# Altium project UNO MEDIA CARRIER.PrjPcb (part 2 of 2)

## Sheet LED_RGB.SchDoc: LED RGB
size A4; SheetNumber: 11; SheetTotal: 11
Used 4 times, as channels U_LED_RGB_1, U_LED_RGB_2, U_LED_RGB_3, U_LED_RGB_4. Parts and nets are listed once, with the designators drawn on the sheet.
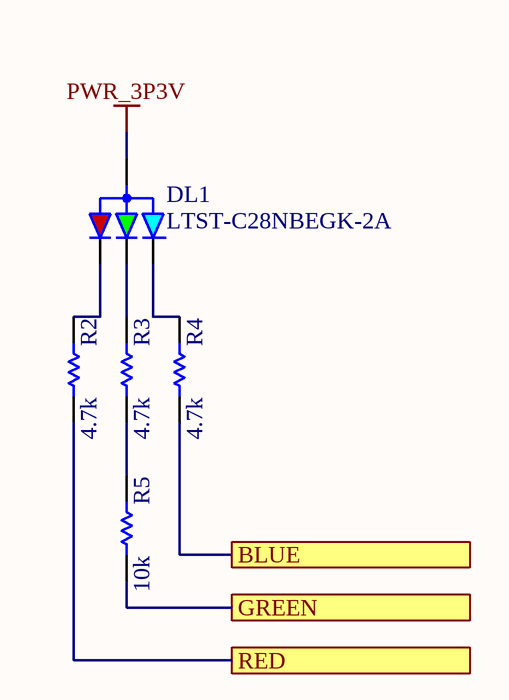
[diagram p10: LED_RGB.SchDoc]

### Parts
DL1  LTST-C28NBEGK-2A  [SMLP34RGB2W]
R2  value 4.7k  [RES-0402]  (hidden comment: RC0402FR-074K7L)
R3  value 4.7k  [RES-0402]  (hidden comment: RC0402FR-074K7L)
R4  value 4.7k  [RES-0402]  (hidden comment: RC0402FR-074K7L)
R5  value 10k  [RES-0402]  (hidden comment: CRCW040210K0FKED)

### Ports
BLUE, GREEN, RED

### Nets
PWR_3P3V: DL1.1(ANODE)
BLUE: R4.1 ; port BLUE
GREEN: R5.2 ; port GREEN
RED: R2.1 ; port RED
NetDL1_2: DL1.2(RED_C) R2.2
NetDL1_3: DL1.3(BLUE_C) R4.2
NetDL1_4: DL1.4(GREEN_C) R3.2
NetR3_1: R3.1 R5.1

### Channels
U_LED_RGB_1: designators end in _1; ports BLUE=NetR4_1_1 GREEN=NetR5_1_2 RED=NetR2_1_1
U_LED_RGB_2: designators end in _2; ports BLUE=NetR4_2_1 GREEN=NetR5_2_2 RED=NetR2_2_1
U_LED_RGB_3: designators end in _3; ports BLUE=NetR4_3_1 GREEN=NetR5_3_2 RED=NetR2_3_1
U_LED_RGB_4: designators end in _4; ports BLUE=NetR4_4_1 GREEN=NetR5_4_2 RED=NetR2_4_1

### Notes on the sheet
- Title:
- ID:
- Date:
- Time:
- Version:
- Sheet
- of
- RevAuthor:
- Reference Designs ARE PROVIDED "AS IS" AND "WITH ALL FAULTS. Arduino SA DISCLAIMS ALL OTHER WARRANTIES, EXPRESS OR IMPLIED, REGARDING PRODUCTS, INCLUDING BUT NOT LIMITED TO, ANY IMPLIED WARRANTIES OF MERCHANTABILITY OR FITNESS FOR A PARTICULAR PURPOSE.
  Arduino SA may make changes to specifications and product descriptions at any time, without notice. The Customer must not rely on the absence or characteristics of any features or instructions marked "reserved" or "undefined". Arduino SA reserves these for future definition and shall have no responsibility whatsoever for conflicts or incompatibilities arising from future changes to them. The product information on the Web Site or Materials is subject to change without notice.
  Do not finalize a design with this info. ARDUINO and other Arduino brands and logos and Trademarks of Arduino SA. All Arduino SA Trademarks cannot be used without owner's formal permission.
- File:
- Author:

### Library data of the parts
DL1 = L0014-A.13: LED RGB DIFFUSED PICOLED SMD; Manufacturer: Liteon; Code Arduino: A5469; Dominant Wavelength: 470nm; Forward Current: 20mA; Luminous Intensity: 45mcd; Forward Voltage: 3V; Lens Color: White; Lens Style: Rectangular; Test Current: 5mA; Pin Count: 4; Part Number: LTST-C28NBEGK-2A; Length: 1mm; Color: Blue,Green,Red; Width: 1mm; Lens Transparency: Diffused; Case Code (Imperial): 0404; Min Operating Temperature: -40°C; Height: 0.25mm; Max Operating Temperature: 85°C
R2-R4 = R0013-A.24: RES CHIP 0402 4k7 1% 1/16W; Manufacturer: YAGEO; Code Arduino: 2196; Power: 62.5mW; Temperature coefficient: 200ppm; Part Number: RC0402FR-074K7L; Tolerance: 1%; Case Code (Imperial): 0402; Technology: Thick film
R5 = R0003-A.24: RES CHIP 0402 10k 1% 1/16W; Manufacturer: Vishay; Code Arduino: 0136; Power: 62.5mW; Temperature coefficient: 100ppm; Case Code (Imperial): 0402; Part Number: CRCW040210K0FKED; Technology: Thick film; Tolerance: 1%

## Nets that join several sheets
+5V: TOP (J13.2), HEADERS_UNOQ_MALE (JMISC_MALE.54 JMISC_MALE.56), HEADERS_UNOQ_FEMALE (J9.54 J9.56)
DC_IN: TOP (J13.3), HEADERS_UNOQ_MALE (JMEDIA_MALE.57 JMEDIA_MALE.59), HEADERS_UNOQ_FEMALE (J8.57 J8.59)
GND: TOP (J10.4 J13.4 QR1.PAD TP21.X), HEADERS_UNOQ_MALE (27 pins), U_FLAT_CSI (8 pins), U_TRANSLATOR_I2C (6 pins), U_FLAT_CSI (8 pins), U_TRANSLATOR_I2C (6 pins), DSI_FLAT (8 pins), AUDIO_EAR (5 pins), AUDIO_HEADPHONES_MIC (7 pins), AUDIO_LINEOUT (D7.A D8.A J7.4 R10.1), HEADERS_UNOQ_FEMALE (27 pins), EXPANDER_I2C (6 pins)
PWR_3P3V: TOP (J13.1 TP22.X), HEADERS_UNOQ_MALE (JMEDIA_MALE.58 JMEDIA_MALE.60 JMISC_MALE.53 JMISC_MALE.55), U_FLAT_CSI (J3_2.22), U_TRANSLATOR_I2C (5 pins), U_FLAT_CSI (J3_1.22), U_TRANSLATOR_I2C (5 pins), DSI_FLAT (J4.22), HEADERS_UNOQ_FEMALE (J8.58 J8.60 J9.53 J9.55), EXPANDER_I2C (6 pins), U_LED_RGB_1 (DL1_1.1), U_LED_RGB_2 (DL1_2.1), U_LED_RGB_3 (DL1_3.1), U_LED_RGB_4 (DL1_4.1)
VBAT: TOP (J10.1), HEADERS_UNOQ_MALE (JMISC_MALE.60), HEADERS_UNOQ_FEMALE (J9.60)
VCC_PX3_1P8: TOP (J10.3 TP20.X), HEADERS_UNOQ_MALE (JMISC_MALE.57), U_TRANSLATOR_I2C (6 pins), U_TRANSLATOR_I2C (6 pins), HEADERS_UNOQ_FEMALE (J9.57)
VCOIN: TOP (J10.2), HEADERS_UNOQ_MALE (JMISC_MALE.59), HEADERS_UNOQ_FEMALE (J9.59)
CSI0_CK_N: HEADERS_UNOQ_MALE (JMEDIA_MALE.33), U_FLAT_CSI (J3_2.8)
CSI0_CK_P: HEADERS_UNOQ_MALE (JMEDIA_MALE.35), U_FLAT_CSI (J3_2.9)
CSI0_D0_N: HEADERS_UNOQ_MALE (JMEDIA_MALE.21), U_FLAT_CSI (J3_2.2)
CSI0_D0_P: HEADERS_UNOQ_MALE (JMEDIA_MALE.23), U_FLAT_CSI (J3_2.3)
CSI0_D1_N: HEADERS_UNOQ_MALE (JMEDIA_MALE.27), U_FLAT_CSI (J3_2.5)
CSI0_D1_P: HEADERS_UNOQ_MALE (JMEDIA_MALE.29), U_FLAT_CSI (J3_2.6)
CSI0_D2_N: HEADERS_UNOQ_MALE (JMEDIA_MALE.39), U_FLAT_CSI (J3_2.11)
CSI0_D2_P: HEADERS_UNOQ_MALE (JMEDIA_MALE.41), U_FLAT_CSI (J3_2.12)
CSI0_D3_N: HEADERS_UNOQ_MALE (JMEDIA_MALE.45), U_FLAT_CSI (J3_2.14)
CSI0_D3_P: HEADERS_UNOQ_MALE (JMEDIA_MALE.47), U_FLAT_CSI (J3_2.15)
CSI1_CK_N: HEADERS_UNOQ_MALE (JMEDIA_MALE.42), U_FLAT_CSI (J3_1.8)
CSI1_CK_P: HEADERS_UNOQ_MALE (JMEDIA_MALE.40), U_FLAT_CSI (J3_1.9)
CSI1_D0_N: HEADERS_UNOQ_MALE (JMEDIA_MALE.54), U_FLAT_CSI (J3_1.2)
CSI1_D0_P: HEADERS_UNOQ_MALE (JMEDIA_MALE.52), U_FLAT_CSI (J3_1.3)
CSI1_D1_N: HEADERS_UNOQ_MALE (JMEDIA_MALE.48), U_FLAT_CSI (J3_1.5)
CSI1_D1_P: HEADERS_UNOQ_MALE (JMEDIA_MALE.46), U_FLAT_CSI (J3_1.6)
CSI1_D2_N: HEADERS_UNOQ_MALE (JMEDIA_MALE.36), U_FLAT_CSI (J3_1.11)
CSI1_D2_P: HEADERS_UNOQ_MALE (JMEDIA_MALE.34), U_FLAT_CSI (J3_1.12)
CSI1_D3_N: HEADERS_UNOQ_MALE (JMEDIA_MALE.30), U_FLAT_CSI (J3_1.14)
CSI1_D3_P: HEADERS_UNOQ_MALE (JMEDIA_MALE.28), U_FLAT_CSI (J3_1.15)
DSI_CLK_N: HEADERS_UNOQ_MALE (JMEDIA_MALE.3), DSI_FLAT (J4.8)
DSI_CLK_P: HEADERS_UNOQ_MALE (JMEDIA_MALE.5), DSI_FLAT (J4.9)
DSI_D0_N: HEADERS_UNOQ_MALE (JMEDIA_MALE.12), DSI_FLAT (J4.2)
DSI_D0_P: HEADERS_UNOQ_MALE (JMEDIA_MALE.10), DSI_FLAT (J4.3)
DSI_D1_N: HEADERS_UNOQ_MALE (JMEDIA_MALE.6), DSI_FLAT (J4.5)
DSI_D1_P: HEADERS_UNOQ_MALE (JMEDIA_MALE.4), DSI_FLAT (J4.6)
DSI_D2_N: HEADERS_UNOQ_MALE (JMEDIA_MALE.9), DSI_FLAT (J4.11)
DSI_D2_P: HEADERS_UNOQ_MALE (JMEDIA_MALE.11), DSI_FLAT (J4.12)
DSI_D3_N: HEADERS_UNOQ_MALE (JMEDIA_MALE.15), DSI_FLAT (J4.14)
DSI_D3_P: HEADERS_UNOQ_MALE (JMEDIA_MALE.17), DSI_FLAT (J4.15)
EAR.EAR_M: HEADERS_UNOQ_MALE (JMISC_MALE.30), AUDIO_EAR (C2.2 D2.C J5.4 R6.2), HEADERS_UNOQ_FEMALE (J9.30)
EAR.EAR_P: HEADERS_UNOQ_MALE (JMISC_MALE.28), AUDIO_EAR (C11.2 D1.C J5.2), HEADERS_UNOQ_FEMALE (J9.28)
GPIO_22: HEADERS_UNOQ_MALE (JMEDIA_MALE.53), U_TRANSLATOR_I2C (R20_2.1 U2_2.4), HEADERS_UNOQ_FEMALE (J8.53)
GPIO_23: HEADERS_UNOQ_MALE (JMEDIA_MALE.51), U_TRANSLATOR_I2C (R21_2.1 U2_2.5), HEADERS_UNOQ_FEMALE (J8.51)
GPIO_29: HEADERS_UNOQ_MALE (JMEDIA_MALE.22), U_TRANSLATOR_I2C (R20_1.1 U2_1.4), HEADERS_UNOQ_FEMALE (J8.22)
GPIO_30: HEADERS_UNOQ_MALE (JMEDIA_MALE.24), U_TRANSLATOR_I2C (R21_1.1 U2_1.5), HEADERS_UNOQ_FEMALE (J8.24)
HEADPHONES.HPH_L: HEADERS_UNOQ_MALE (JMISC_MALE.36), AUDIO_HEADPHONES_MIC (D6.C J6.2), HEADERS_UNOQ_FEMALE (J9.36)
HEADPHONES.HPH_R: HEADERS_UNOQ_MALE (JMISC_MALE.38), AUDIO_HEADPHONES_MIC (D5.C J6.3), HEADERS_UNOQ_FEMALE (J9.38)
HEADPHONES.HS_DET: HEADERS_UNOQ_MALE (JMISC_MALE.42), AUDIO_HEADPHONES_MIC (D3.C J6.10 R14.2), HEADERS_UNOQ_FEMALE (J9.42)
LINEOUT.LINEOUT_M: HEADERS_UNOQ_MALE (JMISC_MALE.34), AUDIO_LINEOUT (D8.C J7.3 R10.2), HEADERS_UNOQ_FEMALE (J9.34)
LINEOUT.LINEOUT_P: HEADERS_UNOQ_MALE (JMISC_MALE.32), AUDIO_LINEOUT (D7.C J7.2), HEADERS_UNOQ_FEMALE (J9.32)
MIC.BIAS: HEADERS_UNOQ_MALE (JMISC_MALE.33), AUDIO_HEADPHONES_MIC (C12.2 R34.1), HEADERS_UNOQ_FEMALE (J9.33)
MIC.INP: HEADERS_UNOQ_MALE (JMISC_MALE.29), AUDIO_HEADPHONES_MIC (D4.C J6.1 R34.2), HEADERS_UNOQ_FEMALE (J9.29)
NetJ3_1_17: TOP (TP16.X), U_FLAT_CSI (J3_1.17), EXPANDER_I2C (U1.3)
NetJ3_1_18: TOP (TP17.X), U_FLAT_CSI (J3_1.18), EXPANDER_I2C (U1.4)
NetJ3_1_20: U_FLAT_CSI (J3_1.20), U_TRANSLATOR_I2C (R23_1.1 U2_1.8)
NetJ3_1_21: U_FLAT_CSI (J3_1.21), U_TRANSLATOR_I2C (R22_1.1 U2_1.1)
NetJ3_2_17: TOP (TP14.X), U_FLAT_CSI (J3_2.17), EXPANDER_I2C (U1.1)
NetJ3_2_18: TOP (TP15.X), U_FLAT_CSI (J3_2.18), EXPANDER_I2C (U1.2)
NetJ3_2_20: TOP (TP18.X), U_FLAT_CSI (J3_2.20), U_TRANSLATOR_I2C (R23_2.1 U2_2.8), DSI_FLAT (J4.20), EXPANDER_I2C (U1.19)
NetJ3_2_21: TOP (TP19.X), U_FLAT_CSI (J3_2.21), U_TRANSLATOR_I2C (R22_2.1 U2_2.1), DSI_FLAT (J4.21), EXPANDER_I2C (U1.20)
NetJ8_16: HEADERS_UNOQ_MALE (JMEDIA_MALE.16), HEADERS_UNOQ_FEMALE (J8.16)
NetJ8_18: HEADERS_UNOQ_MALE (JMEDIA_MALE.18), HEADERS_UNOQ_FEMALE (J8.18)
NetJ9_1: HEADERS_UNOQ_MALE (JMISC_MALE.1), HEADERS_UNOQ_FEMALE (J9.1)
NetJ9_2: HEADERS_UNOQ_MALE (JMISC_MALE.2), HEADERS_UNOQ_FEMALE (J9.2)
NetJ9_3: HEADERS_UNOQ_MALE (JMISC_MALE.3), HEADERS_UNOQ_FEMALE (J9.3)
NetJ9_4: HEADERS_UNOQ_MALE (JMISC_MALE.4), HEADERS_UNOQ_FEMALE (J9.4)
NetJ9_5: HEADERS_UNOQ_MALE (JMISC_MALE.5), HEADERS_UNOQ_FEMALE (J9.5)
NetJ9_6: HEADERS_UNOQ_MALE (JMISC_MALE.6), HEADERS_UNOQ_FEMALE (J9.6)
NetJ9_7: HEADERS_UNOQ_MALE (JMISC_MALE.7), HEADERS_UNOQ_FEMALE (J9.7)
NetJ9_8: HEADERS_UNOQ_MALE (JMISC_MALE.8), HEADERS_UNOQ_FEMALE (J9.8)
NetJ9_9: HEADERS_UNOQ_MALE (JMISC_MALE.9), HEADERS_UNOQ_FEMALE (J9.9)
NetJ9_10: HEADERS_UNOQ_MALE (JMISC_MALE.10), HEADERS_UNOQ_FEMALE (J9.10)
NetJ9_11: HEADERS_UNOQ_MALE (JMISC_MALE.11), HEADERS_UNOQ_FEMALE (J9.11)
NetJ9_12: HEADERS_UNOQ_MALE (JMISC_MALE.12), HEADERS_UNOQ_FEMALE (J9.12)
NetJ9_13: HEADERS_UNOQ_MALE (JMISC_MALE.13), HEADERS_UNOQ_FEMALE (J9.13)
NetJ9_14: HEADERS_UNOQ_MALE (JMISC_MALE.14), HEADERS_UNOQ_FEMALE (J9.14)
NetJ9_15: HEADERS_UNOQ_MALE (JMISC_MALE.15), HEADERS_UNOQ_FEMALE (J9.15)
NetJ9_17: HEADERS_UNOQ_MALE (JMISC_MALE.17), HEADERS_UNOQ_FEMALE (J9.17)
NetJ9_19: HEADERS_UNOQ_MALE (JMISC_MALE.19), HEADERS_UNOQ_FEMALE (J9.19)
NetJ9_20: HEADERS_UNOQ_MALE (JMISC_MALE.20), HEADERS_UNOQ_FEMALE (J9.20)
NetJ9_21: HEADERS_UNOQ_MALE (JMISC_MALE.21), HEADERS_UNOQ_FEMALE (J9.21)
NetJ9_22: HEADERS_UNOQ_MALE (JMISC_MALE.22), HEADERS_UNOQ_FEMALE (J9.22)
NetJ9_23: HEADERS_UNOQ_MALE (JMISC_MALE.23), HEADERS_UNOQ_FEMALE (J9.23)
NetJ9_24: HEADERS_UNOQ_MALE (JMISC_MALE.24), HEADERS_UNOQ_FEMALE (J9.24)
NetJ9_25: HEADERS_UNOQ_MALE (JMISC_MALE.25), HEADERS_UNOQ_FEMALE (J9.25)
NetJ9_37: HEADERS_UNOQ_MALE (JMISC_MALE.37), HEADERS_UNOQ_FEMALE (J9.37)
NetJ9_39: HEADERS_UNOQ_MALE (JMISC_MALE.39), HEADERS_UNOQ_FEMALE (J9.39)
NetJ9_41: HEADERS_UNOQ_MALE (JMISC_MALE.41), HEADERS_UNOQ_FEMALE (J9.41)
NetJ9_43: HEADERS_UNOQ_MALE (JMISC_MALE.43), HEADERS_UNOQ_FEMALE (J9.43)
NetJ9_45: HEADERS_UNOQ_MALE (JMISC_MALE.45), HEADERS_UNOQ_FEMALE (J9.45)
NetJ9_46: HEADERS_UNOQ_MALE (JMISC_MALE.46), HEADERS_UNOQ_FEMALE (J9.46)
NetJ9_47: HEADERS_UNOQ_MALE (JMISC_MALE.47), HEADERS_UNOQ_FEMALE (J9.47)
NetJ9_48: HEADERS_UNOQ_MALE (JMISC_MALE.48), HEADERS_UNOQ_FEMALE (J9.48)
NetJ9_49: HEADERS_UNOQ_MALE (JMISC_MALE.49), HEADERS_UNOQ_FEMALE (J9.49)
NetJ9_50: HEADERS_UNOQ_MALE (JMISC_MALE.50), HEADERS_UNOQ_FEMALE (J9.50)
NetJ9_51: HEADERS_UNOQ_MALE (JMISC_MALE.51), HEADERS_UNOQ_FEMALE (J9.51)
NetJ9_52: HEADERS_UNOQ_MALE (JMISC_MALE.52), HEADERS_UNOQ_FEMALE (J9.52)
NetR2_1_1: EXPANDER_I2C (U1.5), U_LED_RGB_1 (R2_1.1)
NetR2_2_1: EXPANDER_I2C (U1.8), U_LED_RGB_2 (R2_2.1)
NetR2_3_1: EXPANDER_I2C (U1.12), U_LED_RGB_3 (R2_3.1)
NetR2_4_1: EXPANDER_I2C (U1.15), U_LED_RGB_4 (R2_4.1)
NetR4_1_1: EXPANDER_I2C (U1.6), U_LED_RGB_1 (R4_1.1)
NetR4_2_1: EXPANDER_I2C (U1.10), U_LED_RGB_2 (R4_2.1)
NetR4_3_1: EXPANDER_I2C (U1.13), U_LED_RGB_3 (R4_3.1)
NetR4_4_1: EXPANDER_I2C (U1.16), U_LED_RGB_4 (R4_4.1)
NetR5_1_2: EXPANDER_I2C (U1.7), U_LED_RGB_1 (R5_1.2)
NetR5_2_2: EXPANDER_I2C (U1.11), U_LED_RGB_2 (R5_2.2)
NetR5_3_2: EXPANDER_I2C (U1.14), U_LED_RGB_3 (R5_3.2)
NetR5_4_2: EXPANDER_I2C (U1.17), U_LED_RGB_4 (R5_4.2)
PF14: HEADERS_UNOQ_MALE (JMISC_MALE.16), HEADERS_UNOQ_FEMALE (J9.16)
PF15: HEADERS_UNOQ_MALE (JMISC_MALE.18), HEADERS_UNOQ_FEMALE (J9.18)

## Assembly variants
ASX00083: not fitted C11 C? R6 R10 R20_2 R20_3 R21_2 R21_3 R22_2 R22_3 R23_2 R23_3 R? R? R?